# EAGLE design SLG59H1120V_Breakout (EAGLE 6.6.0)
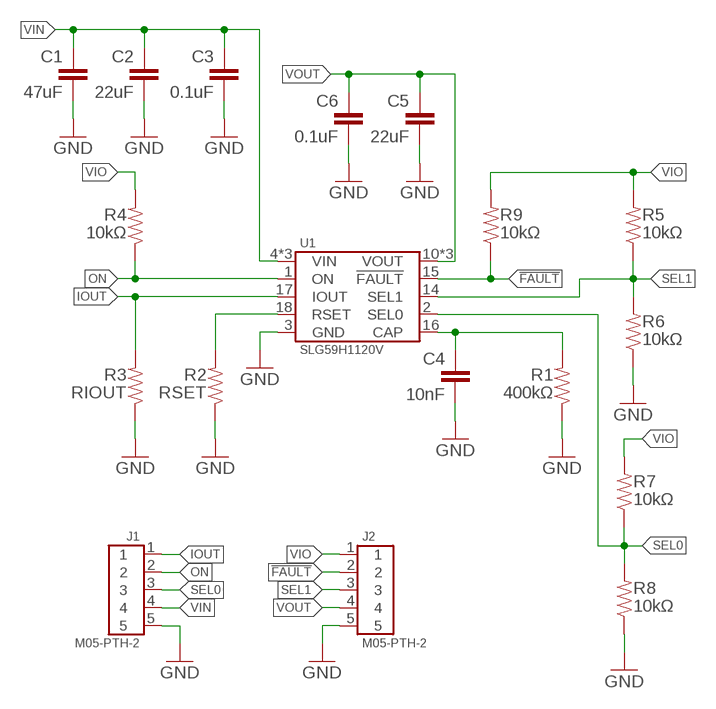
[diagram p0: schematic, sheet 1]

## Parts
C1  47uF  CAP-1206  [1206]
C2  22uF  CAP-1206  [1206]
C3  0.1uF  CAP-0603  [0603-CAP]
C4  10nF  CAP-0603  [0603-CAP]
C5  22uF  CAP-1206  [1206]
C6  0.1uF  CAP-0603  [0603-CAP]
J1  M05-PTH-2  [M05-2]
J2  M05-PTH-2  [M05-2]
R1  400kΩ  RESISTOR-0603  [0603-CAP]
R2  RSET  RESISTOR-0603  [0603-CAP]
R3  RIOUT  RESISTOR-0603  [0603-CAP]
R4  10kΩ  RESISTOR-0603  [0603-CAP]
R5  10kΩ  RESISTOR-0603  [0603-CAP]
R6  10kΩ  RESISTOR-0603  [0603-CAP]
R7  10kΩ  RESISTOR-0603  [0603-CAP]
R8  10kΩ  RESISTOR-0603  [0603-CAP]
R9  10kΩ  RESISTOR-0603  [0603-CAP]
U1  SLG59H1120V  [STQFN-18-1.6X3]

## Nets
!FAULT: J2.2 R9.1 U1.15(!FAULT)
GND: C1.2 C2.2 C3.2 C4.2 C5.2 C6.2 J1.5 J2.5 R1.1 R2.1 R3.1 R6.1 R8.1 U1.3(GND)
IOUT: J1.1 R3.2 U1.17(IOUT)
N$1: R2.2 U1.18(RSET)
N$5: C4.1 R1.2 U1.16(CAP)
ON: J1.2 R4.1 U1.1(ON)
SEL0: J1.3 R7.1 R8.2 U1.2(SEL0)
SEL1: J2.3 R5.1 R6.2 U1.14(SEL1)
VIN: C1.1 C2.1 C3.1 J1.4 U1.4(VIN) U1.5(VIN) U1.6(VIN)
VIO: J2.1 R4.2 R5.2 R7.2 R9.2
VOUT: C5.1 C6.1 J2.4 U1.10(VOUT) U1.11(VOUT) U1.12(VOUT)

## Library data of the parts
C1-C6 = Passives:CAP
J1 J2 = Connectors:M05
R1-R9 = Passives:RESISTOR
U1 = Silego:SLG59H1120V

## Board
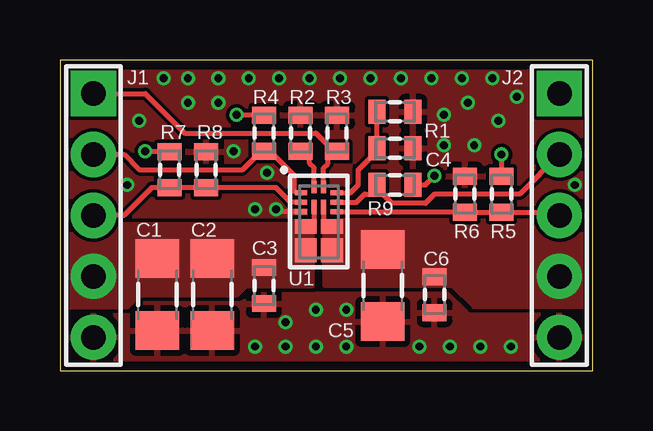
[diagram p1: board, top side]
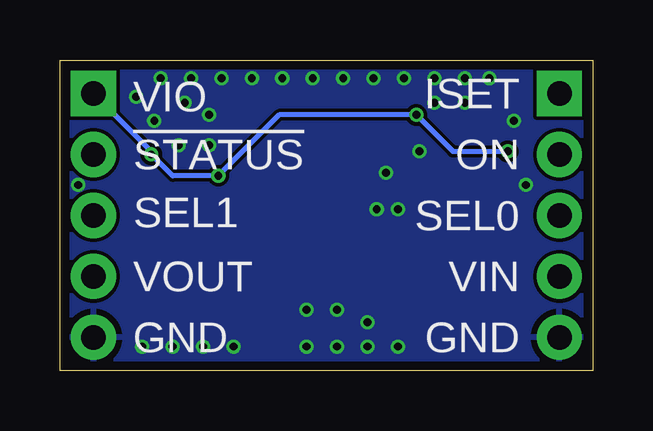
[diagram p2: board, bottom side, seen from below]

Size 22.23 x 12.95 mm. Coordinates in mm from the lower left corner, seen from the top.
Outline: 0,0 22.23,0 22.23,12.95 0,12.95 0,0
Copper layers (1*16): Top 0.035559375mm / dielectric 1.6mm / Bottom 0.035559375mm
Design rules "default *": minimum track width 6mil, minimum drill 10mil, track to track 6mil, track to pad 6mil, pad to pad 6mil, via to via 6mil, smd to smd 6mil, copper to edge 15mil, drill to drill 6mil, minimum pad ring 5mil, minimum via ring 5mil, stop-mask expansion 2.5mil, vias tented up to drill 20mil, thermal gap 10mil

### Footprints (pad centres in the part's own frame; a part is rotated, then mirrored left to right if it is on the bottom)
1206 = smd 1.6 x 1.8: 1 -1.5,0; 2 1.5,0
0603-CAP = smd 0.7 x 1: 1 -0.75,0; 2 0.75,0
M05-2 = drill 1.016 pad 1.88 square: 1 -5.08,0 | drill 1.016 pad 1.88: 2 -2.54,0; 3 0,0; 4 2.54,0; 5 5.08,0
STQFN-18-1.6X3 = smd 0.515 x 0.21: 1 -0.741,1.2; 2 -0.741,0.8; 3 -0.741,0.4; 14 0.741,0.4; 15 0.741,0.8; 16 0.741,1.2 | smd 0.21 x 0.61: 4 -0.2,0.6; 12 0.2,0.6 | smd 0.903 x 0.61: 5 -0.546,-0.2; 11 0.546,-0.2 | smd 0.903 x 1.004: 6 -0.546,-1.197; 10 0.546,-1.197 | smd 0.21 x 0.515: 17 0.2,1.44; 18 -0.2,1.44

### Placement (x,y rotation side)
C1  4.06,3.17 270 top
C2  6.35,3.17 270 top
C3  8.51,3.56 270 top
C4  13.97,9.27 0 top
C5  13.46,3.56 270 top
C6  15.62,3.17 270 top
J1  1.4,6.48 270 top
J2  20.83,6.48 270 top
R1  13.97,10.79 180 top
R2  10.03,9.91 270 top
R3  11.56,9.91 270 top
R4  8.51,9.91 90 top
R5  18.41,7.37 90 top
R6  16.89,7.37 270 top
R7  4.57,8.38 90 top
R8  6.1,8.38 270 top
R9  13.97,7.75 0 top
U1  10.79,6.22 0 top

### Tracks (layer width: path | path; a pad name or v marks a point on that pad's centre or on a via)
!FAULT
  Top 0.203: U1.15 12.36,7.02 12.7,7.37 13.22,7.37 R9.1 13.22,7.61 13.84,6.99 15.24,6.99 15.62,7.37 19.18,7.37 J2.2
GND  (via drill 0.33)
  Top 0.203: U1.3 9.12,6.62 v9.02,6.73
  other vias: 8.13,6.73 18.8,1.02 17.53,1.02 16.26,1.02 14.99,1.02 11.94,1.02 10.67,1.02 9.4,1.02 8.13,1.02 11.94,2.54 10.67,2.54 9.4,2.03 4.32,12.19 5.33,11.18 6.6,11.18 6.6,12.19 5.33,12.19 7.87,12.19 9.14,12.19 10.41,12.19 11.68,12.19 12.95,12.19 14.22,12.19 15.49,12.19 16.76,12.19 18.03,12.19 19.05,11.43 18.29,10.41 17.27,9.4 16,9.4 16,10.67 17.02,11.18 7.24,9.14 3.3,10.41 8.64,8.26 2.79,7.75 21.46,7.75
  pour Top (rank 3): -0.64,13.97 22.86,13.97 22.86,-0.64 -0.64,-0.64
  pour Bottom: -1.27,14.61 23.5,14.61 23.5,-1.27 -1.27,-1.27
IOUT
  Top 0.203: U1.17 10.99,8.46 11.18,8.64 11.18,9.16 R3.2 11.42,9.16 10.67,9.91 5.21,9.91 3.56,11.56 J1.1
N$1
  Top 0.203: U1.18 10.6,8.46 10.41,8.64 10.41,9.16 R2.2
N$5
  Top 0.203: U1.16 12.12,7.42 12.45,7.75 12.45,8.38 13.22,9.16 C4.1 R1.2
ON
  Top 0.203: U1.1 9.85,7.42 9.78,7.49 9.78,8.13 8.75,9.16 R4.1 8.39,9.16 7.62,8.38 3.3,8.38 2.67,9.02 J1.2
SEL0
  Top 0.203: U1.2 9.61,7.02 9.01,7.63 R8.2 R7.1 3.82,7.63 2.67,6.48 J1.3
SEL1
  Top 0.203: J2.3 20.69,6.62 R5.1 R6.2 U1.14
VIN
  Top 0.203: U1.4 10.6,6.02 U1.5
  pour Top (rank 2, no thermals): 10.54,6.22 9.78,6.22 9.65,6.1 0,6.1 0,2.67 2.79,2.67 3.3,3.17 7.37,3.17 7.75,3.56 10.54,3.56
VIO  (via drill 0.33)
  Top 0.203: v7.37,10.67 8.5,10.67 R4.2 | R9.2 15.24,7.75 v15.62,8.13 | v18.41,9.02 R5.2 | v3.56,9.14 4.56,9.14 R7.2
  Bottom 0.203: J2.1 18.41,9.14 v18.41,9.02 17.53,8.13 v15.62,8.13 13.08,10.67 v7.37,10.67 5.84,9.14 v3.56,9.14
VOUT
  Top 0.203: U1.12 10.99,6.02 U1.11
  pour Top (no thermals): 11.05,6.22 11.68,6.22 11.68,6.6 22.23,6.48 22.23,2.67 17.27,2.67 16.38,3.56 11.05,3.56

### Text on the board
bPlace: ISET | VIO | ON | !STATUS | SEL1 | SEL0 | VIN | VOUT | GND | GND